# EAGLE design preamp (EAGLE 6.2)
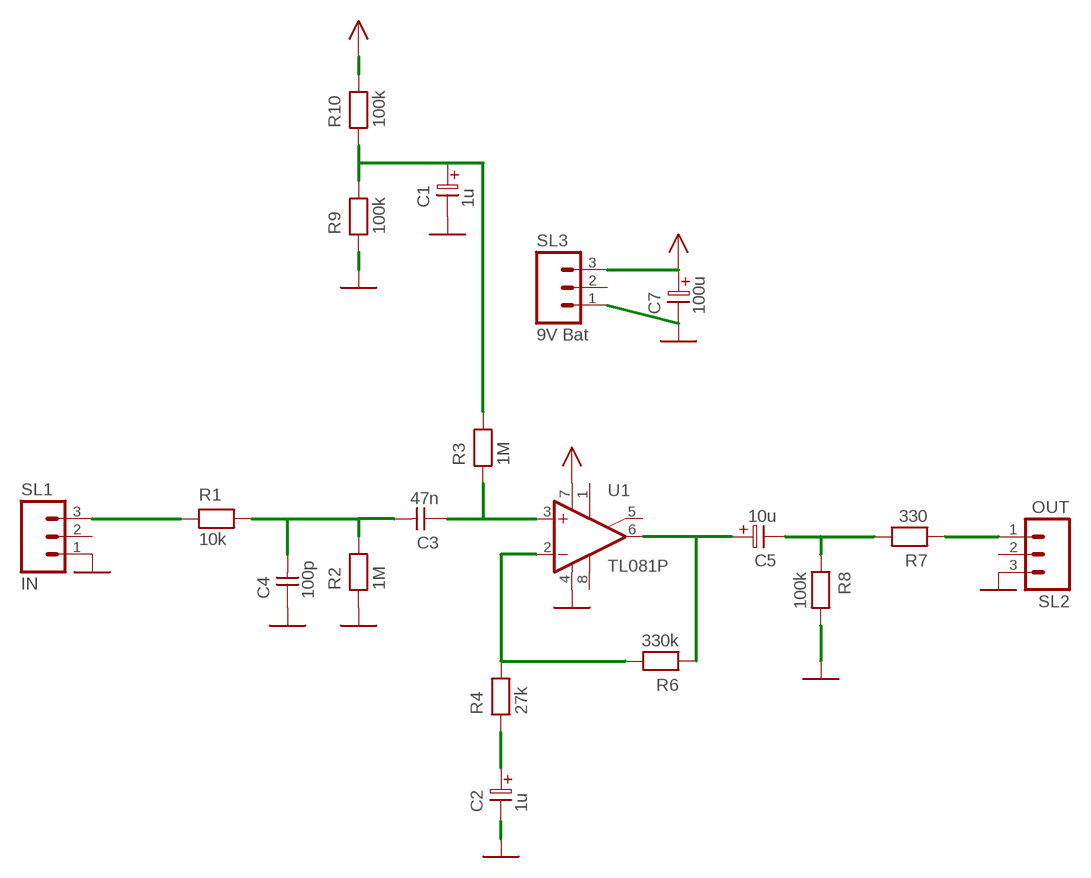
[diagram p0: schematic, sheet 1]

## Parts
C1  1u  ELC-2,5L  [ES-2,5L]
C2  1u  ELC-2,5L  [ES-2,5L]
C3  47n  CAPNP-5  [C-5]
C4  100p  CAPNP-5  [C-5]
C5  10u  ELC-2,5L  [ES-2,5L]
C7  100u  ELC-2,5L  [ES-2,5L]
R1  10k  RESEU-10  [R-10]
R2  1M  RESEU-10  [R-10]
R3  1M  RESEU-10  [R-10]
R4  27k  RESEU-10  [R-10]
R6  330k  RESEU-10  [R-10]
R7  330  RESEU-10  [R-10]
R8  100k  RESEU-10  [R-10]
R9  100k  RESEU-10  [R-10]
R10  100k  RESEU-10  [R-10]
SL1  IN  M03  [03P]
SL2  OUT  M03  [03P]
SL3  9V Bat  M03  [03P]
U1  TL081P  [DIL08]

## Nets
GND: C1.2 C2.2 C4.1 C7.2 R2.1 R8.2 R9.1 SL1.1 SL2.3 SL3.1 U1.4(V-)
N$1: C3.2 C4.2 R1.2 R2.2
N$2: C3.1 R3.1 U1.3(+IN)
N$3: R1.1 SL1.3
N$4: R4.2 R6.2 U1.2(-IN)
N$5: C5.1 R6.1 U1.6(OUT)
N$6: C5.2 R7.2 R8.1
N$7: C2.1 R4.1
N$8: R7.1 SL2.1
N$10: C1.1 R3.2 R9.2 R10.1
VCC: C7.1 R10.2 SL3.3 U1.7(V+)
Unconnected: SL1.2 SL2.2 SL3.2 U1.1(ON1) U1.5(ON2) U1.8(OPT)

## Library data of the parts
C1 C2 C5 C7 = discrete:ELC-2,5L
C3 C4 = discrete:CAPNP-5
R1-R4 R6-R10 = discrete:RESEU-10
SL1-SL3 = conquick:M03
U1 = linear:TL081P

## Board
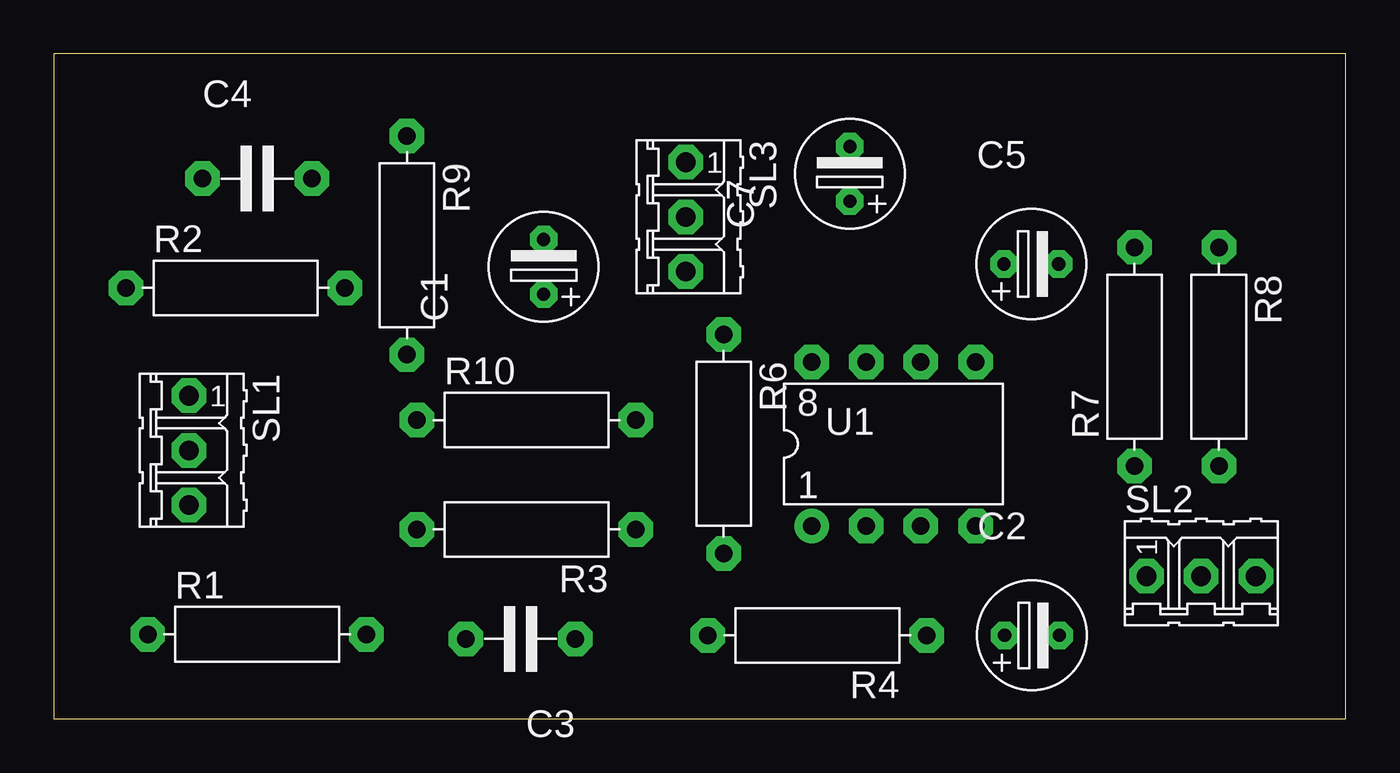
[diagram p1: board, top side]
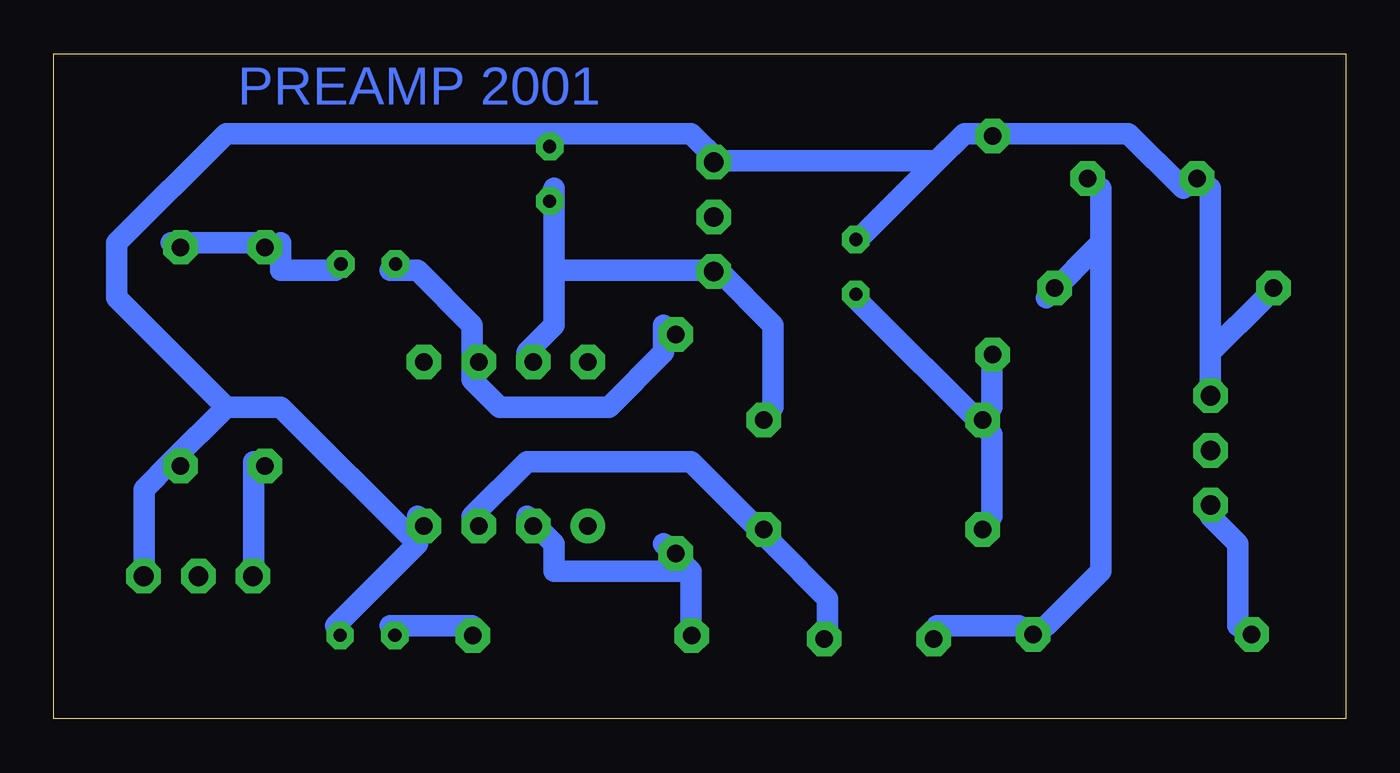
[diagram p2: board, bottom side, seen from below]

Size 60 x 30.87 mm. Coordinates in mm from the lower left corner, seen from the top.
Outline: 0,0 60,0 60,30.87 0,30.87 0,0
Copper layers 16: Bottom 0.035mm
Design rules: minimum track width 10mil, minimum drill 24mil, track to track 8mil, track to pad 8mil, pad to pad 8mil, via to via 8mil, smd to smd 8mil, copper to edge 40mil, drill to drill 8mil, minimum pad ring 10mil, minimum via ring 8mil, stop-mask expansion 4mil, vias tented up to drill 0mil, thermal gap 10mil

### Footprints (pad centres in the part's own frame; a part is rotated, then mirrored left to right if it is on the bottom)
ES-2,5L = drill 0.61 pad 1.27 octagon: 1 0,0; 2 2.54,0
C-5 = drill 0.813 pad 1.6 octagon: 1 -2.54,0; 2 2.54,0
R-10 = drill 0.813 pad 1.6 octagon: 1 -5.08,0; 2 5.08,0
03P = drill 0.914 pad 1.6 octagon: 1 -2.54,0; 2 0,0; 3 2.54,0
DIL08 = drill 0.813 pad 1.6: 1 -3.81,-3.81 | drill 0.813 pad 1.6 octagon: 2 -1.27,-3.81; 3 1.27,-3.81; 4 3.81,-3.81; 5 3.81,3.81; 6 1.27,3.81; 7 -1.27,3.81; 8 -3.81,3.81

### Placement (x,y rotation side)
C1  22.75,19.71 90 top
C2  44.16,3.87 0 top
C3  21.68,3.71 180 top
C4  9.44,25.08 0 top
C5  44.13,21.11 0 top
C7  36.97,24.03 90 top
R1  9.44,3.92 0 top
R2  8.44,20 0 top
R3  21.95,8.79 180 top
R4  35.46,3.87 180 top
R6  31.11,12.76 270 top
R7  50.19,16.81 90 top
R8  54.11,16.81 270 top
R9  16.4,21.98 270 top
R10  21.95,13.87 0 top
SL1  6.28,12.46 270 top
SL2  53.29,6.62 0 top
SL3  29.35,23.3 270 top
U1  39,12.76 0 top

### Tracks (layer width: path | path; a pad name or v marks a point on that pad's centre or on a via)
GND
  Bottom 1: 54.54,11.93 55.81,10.66 55.81,6.85 SL2.3 | 43.11,8.12 46.92,4.31 C2.2 | 43.11,8.12 43.11,9.39 U1.4 | 52,14.47 54.54,11.93 | 52,14.47 49.46,14.47 43.11,8.12 | 54.54,11.93 R8.2 | 6.28,17.01 3.74,19.55 R2.1 | SL1.1 6.28,17.01 | 6.28,17.01 6.28,24.63 C4.1 7.55,24.63 10.09,27.17 16.44,27.17 | 36.76,27.17 30.41,27.17 29.14,25.9 | 18.98,25.9 17.71,27.17 16.44,27.17 | 18.98,25.9 22.79,22.09 C1.2 | 18.98,25.9 29.14,25.9 | 29.14,25.9 SL3.1 | 16.44,27.17 R9.1 | 52,14.47 57.08,19.55 57.08,22.09 52,27.17 36.76,27.17 | 36.76,27.17 C7.2
N$1
  Bottom 1: C3.2 18.98,4.31 15.17,4.31 R1.2 13.9,4.31 11.36,6.85 11.36,22.09 | 11.36,22.09 13.9,19.55 R2.2 | 11.36,22.09 11.36,24.63 C4.2
N$2
  Bottom 1: 26.6,8.12 24.06,5.58 24.06,4.31 C3.1 | 26.6,8.12 30.41,11.93 38.03,11.93 40.57,9.39 U1.3 | 26.6,8.12 R3.1
N$3
  Bottom 1: R1.1 5.01,4.31 5.01,8.12 6.28,9.39 SL1.3
N$4
  Bottom 1: 30.41,6.85 30.41,4.31 R4.2 | 30.41,6.85 31.68,8.12 R6.2 | 30.41,6.85 36.76,6.85 36.76,8.12 38.03,9.39 U1.2
N$5
  Bottom 1: 40.57,17.01 40.57,18.28 43.11,20.82 44.38,20.82 C5.1 | 40.57,17.01 40.57,15.74 39.3,14.47 34.22,14.47 31.68,17.01 31.68,18.28 R6.1 | 40.57,17.01 U1.6
N$6
  Bottom 1: C5.2 46.92,20.82 49.46,20.82 49.46,22.09 R7.2 50.73,22.09 54.54,22.09 R8.1
N$7
  Bottom 1: C2.1 44.38,4.31 40.57,4.31 R4.1
N$8
  Bottom 1: SL2.1 50.73,6.85 50.73,11.93 R7.1
N$10
  Bottom 1: 16.44,13.2 22.79,19.55 C1.1 | 16.44,13.2 16.44,9.39 R3.2 | 16.44,13.2 R10.1 16.44,14.47 16.44,17.01 R9.2
VCC
  Bottom 1: 36.76,20.82 36.76,18.28 38.03,17.01 U1.7 | 36.76,20.82 36.76,24.63 C7.1 | 29.14,20.82 26.6,18.28 26.6,14.47 R10.2 | 29.14,20.82 36.76,20.82 | 29.14,20.82 SL3.3

### Text on the board
Bottom: PREAMP 2001